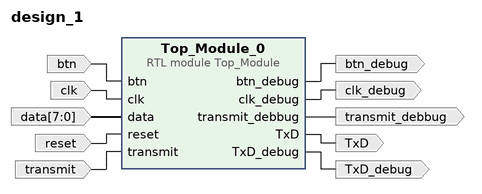
[diagram p0: block diagram of the top level]
# Vivado block design design_1, xc7a35tcpg236-1, Vivado 2021.1
create_bd_design design_1

create_bd_port -dir I -from 7 -to 0 data
create_bd_port -dir I -type clk clk
set_property -dict {CONFIG.FREQ_HZ 100000000} [get_bd_ports clk]
create_bd_port -dir I transmit
create_bd_port -dir I btn
create_bd_port -dir O TxD
create_bd_port -dir I -type rst reset
create_bd_port -dir O TxD_debug
create_bd_port -dir O transmit_debbug
create_bd_port -dir O btn_debug
create_bd_port -dir O clk_debug

create_bd_cell -type module -reference Top_Module Top_Module_0

# ---- connections ----

connect_bd_net [get_bd_pins Top_Module_0/TxD] [get_bd_ports TxD]
connect_bd_net [get_bd_pins Top_Module_0/TxD_debug] [get_bd_ports TxD_debug]
connect_bd_net [get_bd_pins Top_Module_0/btn_debug] [get_bd_ports btn_debug]
connect_bd_net [get_bd_pins Top_Module_0/clk_debug] [get_bd_ports clk_debug]
connect_bd_net [get_bd_pins Top_Module_0/transmit_debbug] [get_bd_ports transmit_debbug]
connect_bd_net [get_bd_ports btn] [get_bd_pins Top_Module_0/btn]
connect_bd_net [get_bd_ports clk] [get_bd_pins Top_Module_0/clk]
connect_bd_net [get_bd_ports data] [get_bd_pins Top_Module_0/data]
connect_bd_net [get_bd_ports reset] [get_bd_pins Top_Module_0/reset]
connect_bd_net [get_bd_ports transmit] [get_bd_pins Top_Module_0/transmit]

validate_bd_design
save_bd_design
